# Altium schematic sheet snes_exp_bridge.SchDoc: SNES Extension Header to IDC Header
size A; DrawnBy: Evan Custodio; Engineer: Evan Custodio; Revision: A
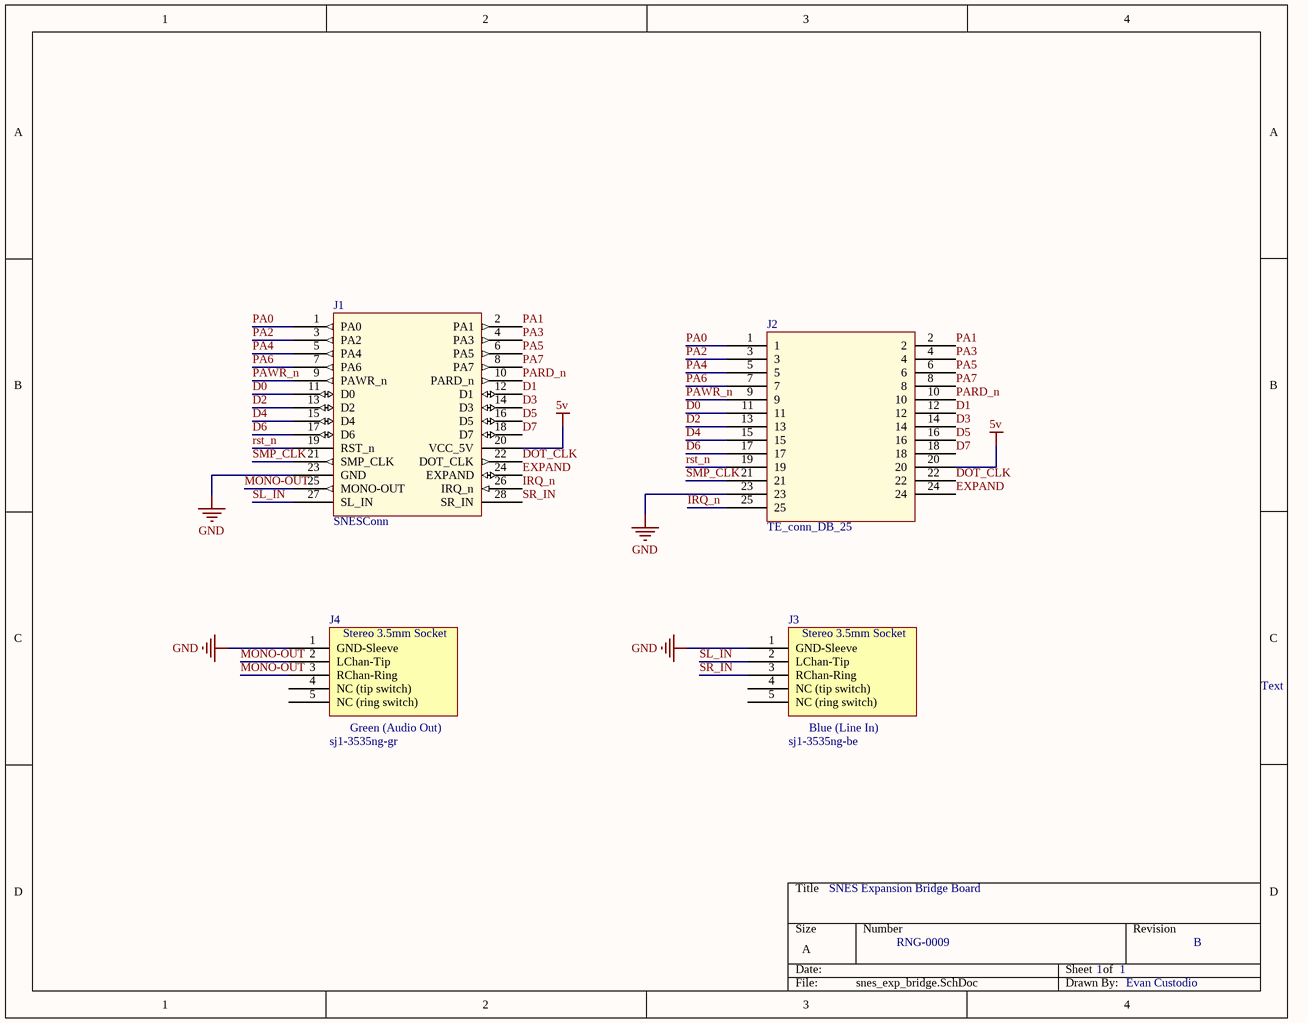
[diagram p0: snes_exp_bridge.SchDoc]

## Parts
J1  SNESConn  [SNES-MEC2-CONN]
J2  TE_conn_DB_25  [DB-25_RA_FSCK]
J3  sj1-3535ng-be  [SJ1-3535NG-BE]
J4  sj1-3535ng-gr  [SJ1-3535NG-GR]

## Nets
5v: J1.20(VCC_5V) J2.20
GND: J1.23(GND) J2.23 J3.1(GND-Sleeve) J4.1(GND-Sleeve)
D0: J1.11(D0) J2.11
D1: J1.12(D1) J2.12
D2: J1.13(D2) J2.13
D3: J1.14(D3) J2.14
D4: J1.15(D4) J2.15
D5: J1.16(D5) J2.16
D6: J1.17(D6) J2.17
D7: J1.18(D7) J2.18
DOT_CLK: J1.22(DOT_CLK) J2.22
EXPAND: J1.24(EXPAND) J2.24
IRQ_n: J1.26(IRQ_n) J2.25
MONO-OUT: J1.25(MONO-OUT) J4.2(LChan-Tip) J4.3(RChan-Ring)
PA0: J1.1(PA0) J2.1
PA1: J1.2(PA1) J2.2
PA2: J1.3(PA2) J2.3
PA3: J1.4(PA3) J2.4
PA4: J1.5(PA4) J2.5
PA5: J1.6(PA5) J2.6
PA6: J1.7(PA6) J2.7
PA7: J1.8(PA7) J2.8
PARD_n: J1.10(PARD_n) J2.10
PAWR_n: J1.9(PAWR_n) J2.9
rst_n: J1.19(RST_n) J2.19
SL_IN: J1.27(SL_IN) J3.2(LChan-Tip)
SMP_CLK: J1.21(SMP_CLK) J2.21
SR_IN: J1.28(SR_IN) J3.3(RChan-Ring)

Not connected (* = marked no-connect by the designer): J3 4(NC_(tip_switch)) 5(NC_(ring_switch)); J4 4(NC_(tip_switch)) 5(NC_(ring_switch))

## Notes on the sheet
- Text
- SNES Expansion Bridge Board
- RNG-0009
- 1
- B
- (in symbol sj1-3535ng-be) Stereo 3.5mm Socket; Blue (Line In)
- (in symbol sj1-3535ng-gr) Stereo 3.5mm Socket; Green (Audio Out)